# Altium schematic sheet Gas_Sampler-Sensors.SchDoc: Sensors
size Tabloid; Organization: Sensible Robotics LLC; Address1: 120 E Church Ave Suite B; Address2: Ridgecrest CA, 93555; Revision: 0; SheetNumber: 9; SheetTotal: 12; ApprovedBy: Approved Name; Engineer: Mike Licitra; PageSetup: Record=PageOptions|CenterHorizontal=True|CenterVertical=True|PrintScale=0.98|XCorrection=1.00|YCorrection=1.00|PrintKind=0|BorderSize=5000000|LeftOffset=0|BottomOffset=0|Orientation=2|PaperLength=1000|PaperWidth=1000|Scale=100|PaperSource=15|PrintQuality=600|MediaType=1|DitherType=10|PaperKind=Tabloid|PrintScaleMode=1
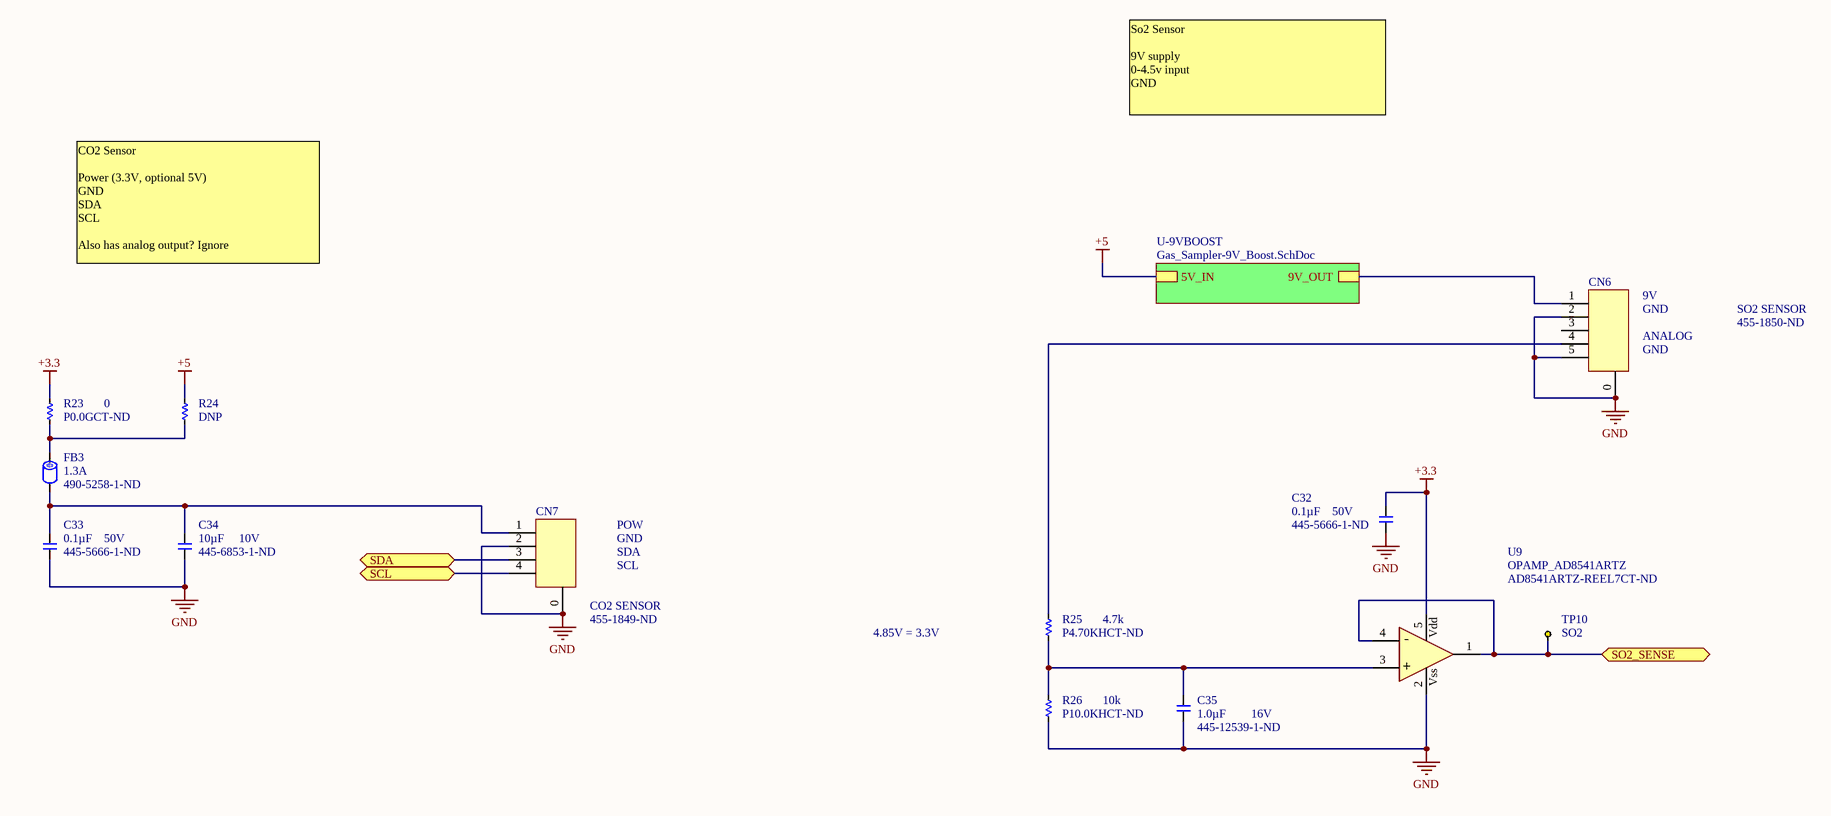
[diagram p0: Gas_Sampler-Sensors.SchDoc]

## Parts
C32  value 0.1µF  Voltage - Rated: 50V  Supplier Part Number 1: 445-5666-1-ND  [C0603]  (hidden comment: CAP_CER_0603_0.1UF_50V_10%_X7R)
C33  value 0.1µF  Voltage - Rated: 50V  Supplier Part Number 1: 445-5666-1-ND  [C0603]  (hidden comment: CAP_CER_0603_0.1UF_50V_10%_X7R)
C34  value 10µF  Voltage - Rated: 10V  Supplier Part Number 1: 445-6853-1-ND  [C0603]  (hidden comment: CAP_CER_0603_10UF_10V_20%_X5R)
C35  value 1.0µF  Supplier Part Number 1: 445-12539-1-ND  Voltage - Rated: 16V  [C0603]  (hidden comment: CAP_CER_0603_1UF_16V_10%_X7R)
CN6  SO2 SENSOR  Supplier Part Number 1: 455-1850-ND  [JST_PA_S05B-PASK-2]
CN7  CO2 SENSOR  Supplier Part Number 1: 455-1849-ND  [JST_PA_S04B-PASK-2]
FB3  Current Rating (Max): 1.3A  Supplier Part Number 1: 490-5258-1-ND  [R0603]  (hidden comment: FERRITE_BEAD_0603_1.3A_600_OHM)
R23  value 0  Supplier Part Number 1: P0.0GCT-ND  [R0603]  (hidden comment: RES_0603_0_OHM_1/10W)
R24  value DNP  [R0603]  (hidden comment: RES_0603_DNP)  (no BOM)
R25  value 4.7k  Supplier Part Number 1: P4.70KHCT-ND  [R0603]  (hidden comment: RES_0603_4.7K_OHM_1/10W_1%)
R26  value 10k  Supplier Part Number 1: P10.0KHCT-ND  [R0603]  (hidden comment: RES_0603_10K_OHM_1/10W_1%)
TP10  SO2  [TP_KEYSTONE_5001]
U9  OPAMP_AD8541ARTZ  Supplier Part Number 1: AD8541ARTZ-REEL7CT-ND  [5SOT23]

## Sub-sheets
U-9VBOOST = Gas_Sampler-9V_Boost.SchDoc: 9V_OUT, 5V_IN

## Ports
SCL, SDA, SO2_SENSE

## Nets
+3.3: C32.1 R23.2 U9.5(VDD)
+5: R24.2 ; sheet U-9VBOOST/5V_IN
GND: C32.2 C33.2 C34.2 C35.2 CN6.0(CHAS) CN6.2 CN6.5 CN7.0(CHAS) CN7.2 R26.1 U9.2(VSS)
SCL: CN7.4 ; port SCL
SDA: CN7.3 ; port SDA
SO2_SENSE: TP10.1 U9.1(OUT) U9.4(IN-) ; port SO2_SENSE
NetC33_1: C33.1 C34.1 CN7.1 FB3.2
NetC35_1: C35.1 R25.1 R26.2 U9.3(IN+)
NetCN6_1: CN6.1 ; sheet U-9VBOOST/9V_OUT
NetCN6_4: CN6.4 R25.2
NetFB3_1: FB3.1 R23.1 R24.1

Not connected (* = marked no-connect by the designer): CN6 3

## Notes on the sheet
- So2 Sensor
  9V supply
  0-4.5v input
  GND
- CO2 Sensor
  Power (3.3V, optional 5V)
  GND
  SDA
  SCL
  Also has analog output? Ignore
- (near CN6) 9V
- (near CN6) GND
- (near CN6) ANALOG
- POW
- GND
- SDA
- SCL
- 4.85V = 3.3V
- CONFIDENTIAL DOCUMENT
- DUPLICATION PROHIBITED
- ENGINEER
- PCB FAB #
- SCH #
- REV
- Sensible
- Robotics
- THIS DOCUMENT CONTAINS INFORMATION AND OR DATA, WHICH IS PROPRIETARY AND CONFIDENTIAL TO SENSIBLE ROBOTICS LLC.  THIS INFORMATION AND OR DATA, IS TO BE USED ONLY FOR THE BENEFIT OF THE SUPPLIER, AND IS NOT TO BE USED FOR THE BENEFIT OF OTHER PARTIES WITHOUT WRITTEN CONSENT.
- DATE
- PCB ASSY #
- SIZE
- Tabloid
- SHEET
- OF
- FILE
- (in symbol OPAMP_AD8541ARTZ) Vdd; +; Vss

## Library data of the parts
C32 C33 = CAP_CER_0603_0.1UF_50V_10%_X7R: CAP CER 0.1UF 50V 10% X7R 0603; Manufacturer: TDK Corporation; Manufacturer Part Number: CGA3E2X7R1H104K080AA; Part Number: 150-00077-00; Supplier 1: Digi-Key; RoHS: RoHS Compliant; Category: Capacitors; Stock 1: 320000; Pricing 1: 1=0.1, 10=0.072, 100=0.033, 250=0.027, 500=0.0231, 1000=0.018 (USD); Packaging: Cut Tape (CT); Tolerance: ±10%; Temperature Coefficient: X7R; Mounting Type: Surface Mount, MLCC; Operating Temperature: -55°C ~ 125°C; Applications: Automotive; Ratings: AEC-Q200; Package / Case: 0603 (1608 Metric); Size / Dimension: 0.063" L x 0.031" W (1.60mm x 0.80mm); Height - Seated (Max): -; Thickness (Max): 0.035" (0.90mm); Lead Spacing: -; Features: -; Lead Style: -; ComponentLink1URL: http://product.tdk.com/capacitor/mlcc/en/documents/mlcc_automotive_general_en.pdf; ComponentLink1Description: http://product.tdk.com/capacitor/mlcc/en/documents/mlcc_automotive_general_en.pdf
C34 = CAP_CER_0603_10UF_10V_20%_X5R: CAP CER 10UF 10V X5R 0603; Manufacturer: TDK Corporation; Manufacturer Part Number: C1608X5R1A106M080AC; Tolerance: ±20%; Supplier 1: Digi-Key; RoHS: RoHS Compliant; Packaging: Cut Tape (CT); Part Status: Active; Temperature Coefficient: X5R; Operating Temperature: -55°C ~ 85°C; Features: Low ESL; Applications: General Purpose; Mounting Type: Surface Mount, MLCC; Package / Case: 0603 (1608 Metric); Size / Dimension: 0.063" L x 0.032" W (1.60mm x 0.80mm); Thickness (Max): 0.035" (0.90mm); ComponentLink1URL: https://product.tdk.com/info/en/catalog/datasheets/mlcc_commercial_general_en.pdf; ComponentLink1Description: https://product.tdk.com/info/en/catalog/datasheets/mlcc_commercial_general_en.pdf
C35 = CAP_CER_0603_1UF_16V_10%_X7R: CAP CER 1UF 16V 10% X7R 0603; Manufacturer: TDK Corporation; Manufacturer Part Number: CGA3E1X7R1C105K080AC; Supplier 1: Digi-Key; RoHS: RoHS Compliant; Packaging: Cut Tape (CT); Tolerance: ±10%; Temperature Coefficient: X7R; Mounting Type: Surface Mount, MLCC; Operating Temperature: -55°C ~ 125°C; Applications: Automotive; Ratings: AEC-Q200; Package / Case: 0603 (1608 Metric); Size / Dimension: 0.063" L x 0.031" W (1.60mm x 0.80mm); Thickness (Max): 0.035" (0.90mm); ComponentLink1URL: http://product.tdk.com/capacitor/mlcc/en/documents/mlcc_automotive_general_en.pdf; ComponentLink1Description: http://product.tdk.com/capacitor/mlcc/en/documents/mlcc_automotive_general_en.pdf
CN6 = JST_PA_RA_TH_GUIDE_5POS: CONN HEADER PA 5POS SIDE 2MM TIN; Manufacturer: JST Sales America Inc.; Manufacturer Part Number: S05B-PASK-2(LF)(SN); Connector Type: Header, Shrouded; Number of Positions: 5; Number of Positions Loaded: All; Pitch: 0.079" (2.00mm); Supplier 1: Digi-Key; Packaging: Bulk; Contact Type: Male Pin; Contact Mating Length: 0.126" (3.20mm); Mounting Type: Through Hole, Right Angle; Termination: Kinked Pin, Solder; Fastening Type: Locking Ramp; Features: Board Guide; Contact Finish: Tin; ComponentLink1URL: http://www.jst-mfg.com/product/pdf/eng/ePA-F.pdf; ComponentLink1Description: http://www.jst-mfg.com/product/pdf/eng/ePA-F.pdf
CN7 = JST_PA_RA_TH_GUIDE_4POS: CONN HEADER PA 4POS SIDE 2MM TIN; Manufacturer: JST Sales America Inc.; Manufacturer Part Number: S04B-PASK-2(LF)(SN); Connector Type: Header, Shrouded; Number of Positions: 4; Number of Positions Loaded: All; Pitch: 0.079" (2.00mm); Supplier 1: Digi-Key; Packaging: Bulk; Contact Type: Male Pin; Contact Mating Length: 0.126" (3.20mm); Mounting Type: Through Hole, Right Angle; Termination: Kinked Pin, Solder; Fastening Type: Locking Ramp; Features: Board Guide; Contact Finish: Tin; ComponentLink1URL: http://www.jst-mfg.com/product/pdf/eng/ePA-F.pdf; ComponentLink1Description: http://www.jst-mfg.com/product/pdf/eng/ePA-F.pdf
FB3 = FERRITE_BEAD_0603_1.3A_600_OHM: FERRITE BEAD 600 OHM 0603 1LN; Manufacturer: Murata Electronics North America; Manufacturer Part Number: BLM18KG601SN1D; Filter Type: Power Line; Number of Lines: 1; Impedance @ Frequency: 600 Ohm @ 100MHz; DC Resistance (DCR) (Max): 150 mOhm; Supplier 1: Digi-Key; RoHS: RoHS Compliant; Category: Filters; Stock 1: 300163; Packaging: Cut Tape (CT); Operating Temperature: -55°C ~ 125°C; Package / Case: 0603 (1608 Metric); Mounting Type: Surface Mount; Height (Max): 0.037" (0.95mm); Size / Dimension: 0.063" L x 0.032" W (1.60mm x 0.80mm); ComponentLink1URL: http://media.digikey.com/pdf/Data%20Sheets/Murata%20PDFs/BLM18yyyyyyN1x.pdf; ComponentLink1Description: http://media.digikey.com/pdf/Data%20Sheets/Murata%20PDFs/BLM18yyyyyyN1x.pdf
R23 = RES_0603_0_OHM_1/10W: RES 0.0 OHM 1/10W JUMP 0603 SMD; Manufacturer: Panasonic Electronic Components; Manufacturer Part Number: ERJ-3GEY0R00V; Power (Watts): 0.1W, 1/10W; Tolerance: Jumper; Supplier 1: Digi-Key; Category: Resistors; Packaging: Cut Tape (CT); Composition: Thick Film; Package / Case: 0603 (1608 Metric); Supplier Device Package: 0603; Size / Dimension: 0.063" L x 0.031" W (1.60mm x 0.80mm); Height: 0.022" (0.55mm); Number of Terminations: 2; ComponentLink1URL: http://industrial.panasonic.com/www-cgi/jvcr13pz.cgi?E+PZ+3+AOA0001+ERJ3GEY0R00V+7+WW; ComponentLink1Description: http://industrial.panasonic.com/www-cgi/jvcr13pz.cgi?E+PZ+3+AOA0001+ERJ3GEY0R00V+7+WW
R24 = RES_0603_DNP: RES DNP 0603 SMD; Part Number: 000-00000-00; Supplier 1: Digi-Key; Supplier Part Number 1: DNP
R25 = RES_0603_4.7K_OHM_1/10W_1%: RES 4.7K OHM 1/10W 1% 0603 SMD; Manufacturer: Panasonic Electronic Components; Manufacturer Part Number: ERJ-3EKF4701V; Power (Watts): 0.1W, 1/10W; Temperature Coefficient: ±100ppm/°C; Supplier 1: Digi-Key; Category: Resistors; Packaging: Cut Tape (CT); Composition: Thick Film; Tolerance: ±1%; Package / Case: 0603 (1608 Metric); Supplier Device Package: 0603; Size / Dimension: 0.063" L x 0.031" W (1.60mm x 0.80mm); Height: 0.022" (0.55mm); Number of Terminations: 2; ComponentLink1URL: http://industrial.panasonic.com/www-cgi/jvcr13pz.cgi?E+PZ+3+AOA0002+ERJ3EKF4701V+7+WW; ComponentLink1Description: http://industrial.panasonic.com/www-cgi/jvcr13pz.cgi?E+PZ+3+AOA0002+ERJ3EKF4701V+7+WW
R26 = RES_0603_10K_OHM_1/10W_1%: RES 10K OHM 1/10W 1% 0603 SMD; Manufacturer: Panasonic Electronic Components; Manufacturer Part Number: ERJ-3EKF1002V; Power (Watts): 0.1W, 1/10W; Temperature Coefficient: ±100ppm/°C; Supplier 1: Digi-Key; RoHS: RoHS Compliant; Packaging: Cut Tape (CT); Composition: Thick Film; Tolerance: ±1%; Package / Case: 0603 (1608 Metric); Supplier Device Package: 0603; Size / Dimension: 0.063" L x 0.031" W (1.60mm x 0.80mm); Height: 0.022" (0.55mm); Number of Terminations: 2; ComponentLink1URL: http://industrial.panasonic.com/www-cgi/jvcr13pz.cgi?E+PZ+3+AOA0002+ERJ3EKF1002V+7+WW; ComponentLink1Description: http://industrial.panasonic.com/www-cgi/jvcr13pz.cgi?E+PZ+3+AOA0002+ERJ3EKF1002V+7+WW
TP10 = TEST_KEYSTONE5001: PC TEST POINT TH RING; Manufacturer: Keystone Electronics; Manufacturer Part Number: 5001; Part Number: 250-00184-00; Supplier 1: Digi-Key; Supplier Part Number 1: 5001K-ND; RoHS: RoHS Compliant; Category: Test and Measurement; Stock 1: 341830; Pricing 1: 1=0.33, 10=0.309, 50=0.2252, 100=0.2164, 250=0.19432, 500=0.18548, 1000=0.15456, 2500=0.14131, 5000=0.13248 (USD); Packaging: Bulk; Type: PC Test Point, Miniature; Terminal: 0.010" x 0.020" (0.25mm x 0.51mm) Phosphor Bronze Wire, Silver Plate; Mounting Type: 0.040" (1.02mm) Hole Diameter; Material: Base, Nylon 46, UL 94V-0; Color: Black; ComponentLink1URL: http://www.keyelco.com/product-pdf.cfm?p=1310; ComponentLink1Description: http://www.keyelco.com/product-pdf.cfm?p=1310
U9 = OPAMP_AD8541ARTZ: IC OPAMP GP R-R CMOS SOT23-5; Manufacturer: Analog Devices Inc; Manufacturer Part Number: AD8541ARTZ-REEL7; Part Number: 480-00120-00; Amplifier Type: General Purpose; Number of Circuits: 1; Output Type: Rail-to-Rail; Slew Rate: 0.92 V/µs; Gain Bandwidth Product: 1MHz; Current - Input Bias: 4pA; Voltage - Input Offset: 1mV; Current - Supply: 45µA; Current - Output / Channel: 30mA; Voltage - Supply, Single/Dual (±): 2.7 V ~ 5.5 V; Supplier 1: Digi-Key; RoHS: RoHS Compliant; Category: Integrated Circuits (ICs); Stock 1: 26612; Pricing 1: 1=0.85, 10=0.747, 25=0.6604, 100=0.5755, 250=0.50096, 500=0.42642, 1000=0.34155 (USD); Packaging: Cut Tape (CT); -3db Bandwidth: -; Operating Temperature: -40°C ~ 125°C; Mounting Type: Surface Mount; Package / Case: SC-74A, SOT-753; Supplier Device Package: SOT-23-5; ComponentLink1URL: http://www.analog.com/static/imported-files/data_sheets/AD8541_8542_8544.pdf; ComponentLink1Description: http://www.analog.com/static/imported-files/data_sheets/AD8541_8542_8544.pdf